# EAGLE schematic M248B (EAGLE 6.6.0)
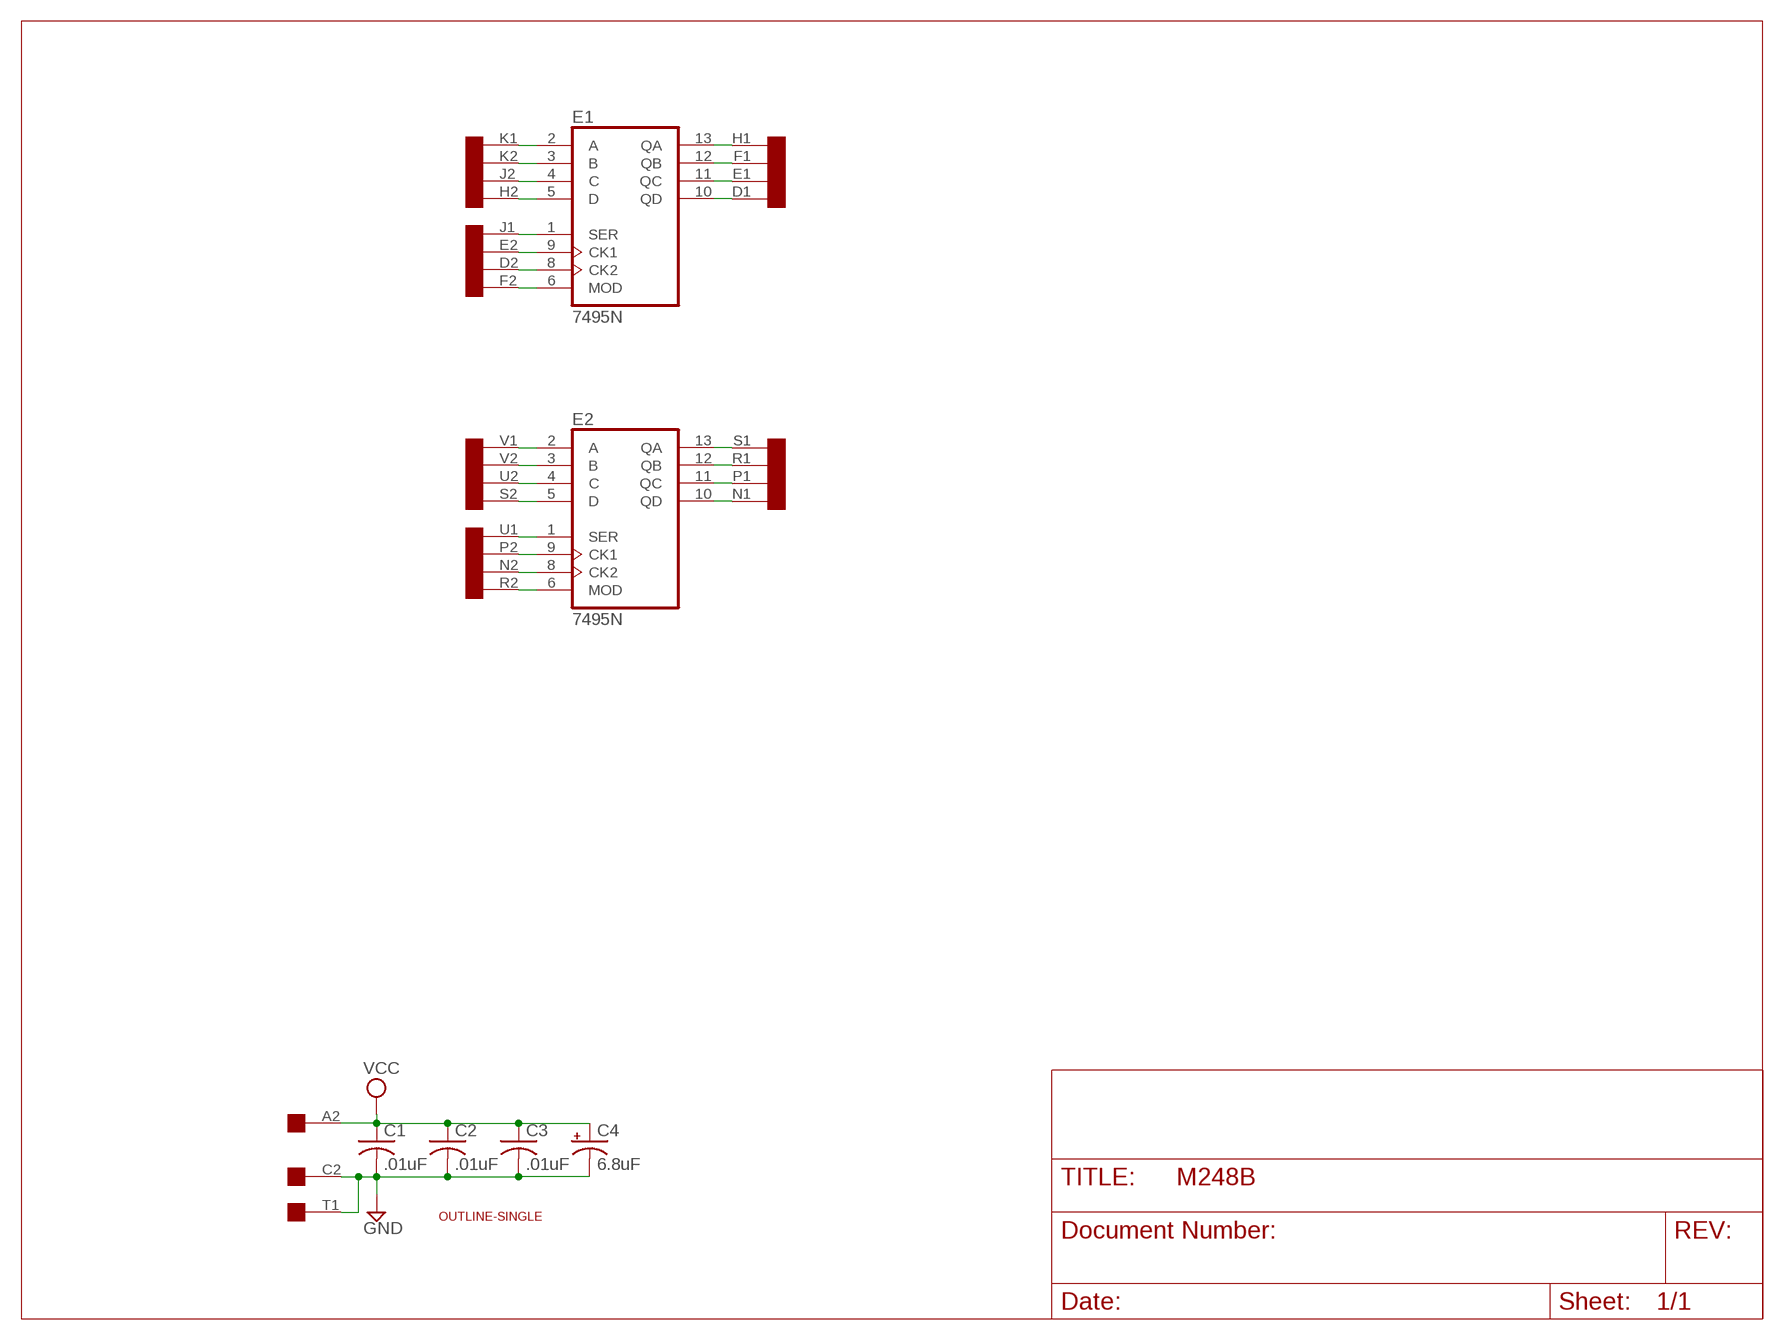
[diagram p0: schematic, sheet 1]

## Parts
C1  .01uF  C-US050-025X075  [C050-025X075]
C2  .01uF  C-US050-025X075  [C050-025X075]
C3  .01uF  C-US050-025X075  [C050-025X075]
C4  6.8uF  CPOL-USE20-8AXIAL  [E12-8]
E1  7495N  [DIL14]
E2  7495N  [DIL14]
U$1  OUTLINE-SINGLE  [SINGLE]
U$2  SINGLE  [EDGE-CON2]

## Nets
GND: C1.2 C2.2 C3.2 C4.- U$2.C2 U$2.T1
N$1: E1.1(SER) U$2.J1
N$2: E1.2(A) U$2.K1
N$3: E1.3(B) U$2.K2
N$4: E1.4(C) U$2.J2
N$5: E1.5(D) U$2.H2
N$6: E1.6(MOD) U$2.F2
N$7: E1.8(CK2) U$2.D2
N$8: E1.9(CK1) U$2.E2
N$9: E1.10(QD) U$2.D1
N$10: E1.11(QC) U$2.E1
N$11: E1.12(QB) U$2.F1
N$12: E1.13(QA) U$2.H1
N$13: E2.1(SER) U$2.U1
N$14: E2.2(A) U$2.V1
N$15: E2.3(B) U$2.V2
N$16: E2.4(C) U$2.U2
N$17: E2.5(D) U$2.S2
N$18: E2.6(MOD) U$2.R2
N$19: E2.8(CK2) U$2.N2
N$20: E2.9(CK1) U$2.P2
N$21: E2.10(QD) U$2.N1
N$22: E2.11(QC) U$2.P1
N$23: E2.12(QB) U$2.R1
N$24: E2.13(QA) U$2.S1
VCC: C1.1 C2.1 C3.1 C4.+ U$2.A2
Unconnected: U$2.A1 U$2.B1 U$2.B2 U$2.C1 U$2.L1 U$2.L2 U$2.M1 U$2.M2 U$2.T2

## Power pins joined to a net without a drawn wire
GND: E1.7(GND) E2.7(GND)
VCC: E1.14(VCC) E2.14(VCC)

## Library data of the parts
C1-C3 = rcl:C-US: CAPACITOR, American symbol
C4 = dec-con:CPOL-USE20-8AXIAL: A 0.8 inch electrolytic.
E1 E2 = 74xx-us:74*95: 4-bit parallel access SHIFT REGISTER
U$1 = dec-con:OUTLINE-*: Board outlines for DEC boards.
U$2 = dec-con:SINGLE: Single-Height DEC board

## Net classes
0 default: width 0.813 mm